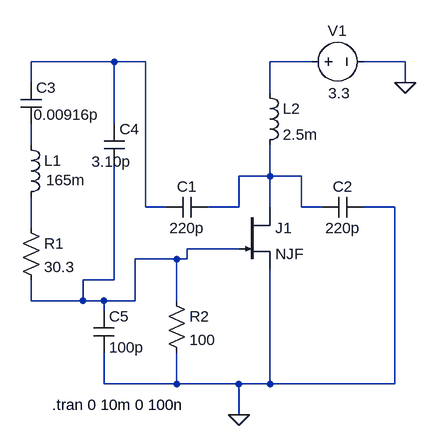
[diagram p0: schematic Quartz Crystal Oscillator.asc]
Quartz Crystal Oscillator.asc, the LTspice schematic file:
Version 4
SHEET 1 880 680
WIRE 16 -80 -112 -80
WIRE 64 -80 16 -80
WIRE 320 -80 256 -80
WIRE 464 -80 400 -80
WIRE -112 -48 -112 -80
WIRE 464 -48 464 -80
WIRE 256 -32 256 -80
WIRE 16 16 16 -80
WIRE -112 48 -112 16
WIRE 256 96 256 48
WIRE 256 96 208 96
WIRE 304 96 256 96
WIRE 64 144 64 -80
WIRE 96 144 64 144
WIRE 208 144 208 96
WIRE 208 144 160 144
WIRE 256 144 256 96
WIRE 304 144 304 96
WIRE 336 144 304 144
WIRE 448 144 400 144
WIRE -112 176 -112 128
WIRE 208 208 128 208
WIRE 112 224 48 224
WIRE 128 224 128 208
WIRE 128 224 112 224
WIRE 16 256 16 80
WIRE 16 256 -32 256
WIRE -112 288 -112 256
WIRE -32 288 -32 256
WIRE -32 288 -112 288
WIRE 0 288 -32 288
WIRE 48 288 48 224
WIRE 48 288 0 288
WIRE 112 288 112 224
WIRE 0 304 0 288
WIRE 0 416 0 368
WIRE 112 416 112 368
WIRE 112 416 0 416
WIRE 208 416 112 416
WIRE 256 416 256 240
WIRE 256 416 208 416
WIRE 448 416 448 144
WIRE 448 416 256 416
WIRE 208 464 208 416
FLAG 208 464 0
FLAG 464 -48 0
SYMBOL njf 208 144 R0
SYMATTR InstName J1
SYMBOL cap 160 128 R90
WINDOW 0 0 32 VBottom 2
WINDOW 3 32 32 VTop 2
SYMATTR InstName C1
SYMATTR Value 220p
SYMBOL cap 400 128 R90
WINDOW 0 0 32 VBottom 2
WINDOW 3 32 32 VTop 2
SYMATTR InstName C2
SYMATTR Value 220p
SYMBOL ind -128 32 R0
WINDOW 3 39 70 Left 2
SYMATTR Value 165m
SYMATTR InstName L1
SYMBOL res -128 160 R0
SYMATTR InstName R1
SYMATTR Value 30.3
SYMBOL res 96 272 R0
SYMATTR InstName R2
SYMATTR Value 100
SYMBOL cap -16 304 R0
SYMATTR InstName C5
SYMATTR Value 100p
SYMBOL cap -128 -48 R0
WINDOW 3 20 49 Left 2
SYMATTR Value 0.00916p
SYMATTR InstName C3
SYMBOL cap 0 16 R0
WINDOW 3 -19 58 Left 2
SYMATTR Value 3.10p
SYMATTR InstName C4
SYMBOL ind 240 -48 R0
SYMATTR InstName L2
SYMATTR Value 2.5m
SYMBOL voltage 304 -80 R270
WINDOW 0 32 56 VTop 2
WINDOW 3 -64 59 VTop 2
WINDOW 123 8 155 VTop 2
WINDOW 39 0 0 Left 0
SYMATTR InstName V1
SYMATTR Value 3.3
TEXT -80 448 Left 2 !.tran 0 10m 0 100n

The netlist it stands for:
* Quartz Crystal Oscillator.asc
J1 N004 N006 0 NJF
C1 N004 N001 220p
C2 0 N004 220p
L1 N003 N005 165m
R1 N005 N006 30.3
R2 N006 0 100
C5 N006 0 100p
C3 N001 N003 0.00916p
C4 N001 N006 3.10p
L2 N002 N004 2.5m
V1 N002 0 3.3
.model NJF NJF
.model PJF PJF
.lib standard.jft
.tran 0 10m 0 100n
.backanno
.end